# Altium schematic sheet LaserDriver.SchDoc: LaserDriver
size A3; Organization: Altium Limited; Address1: L3, 12a Rodborough Rd; Address2: Frenchs Forest; Address3: NSW; Address4: Australia 2086; SheetNumber: 1; SheetTotal: 1; Version: 1
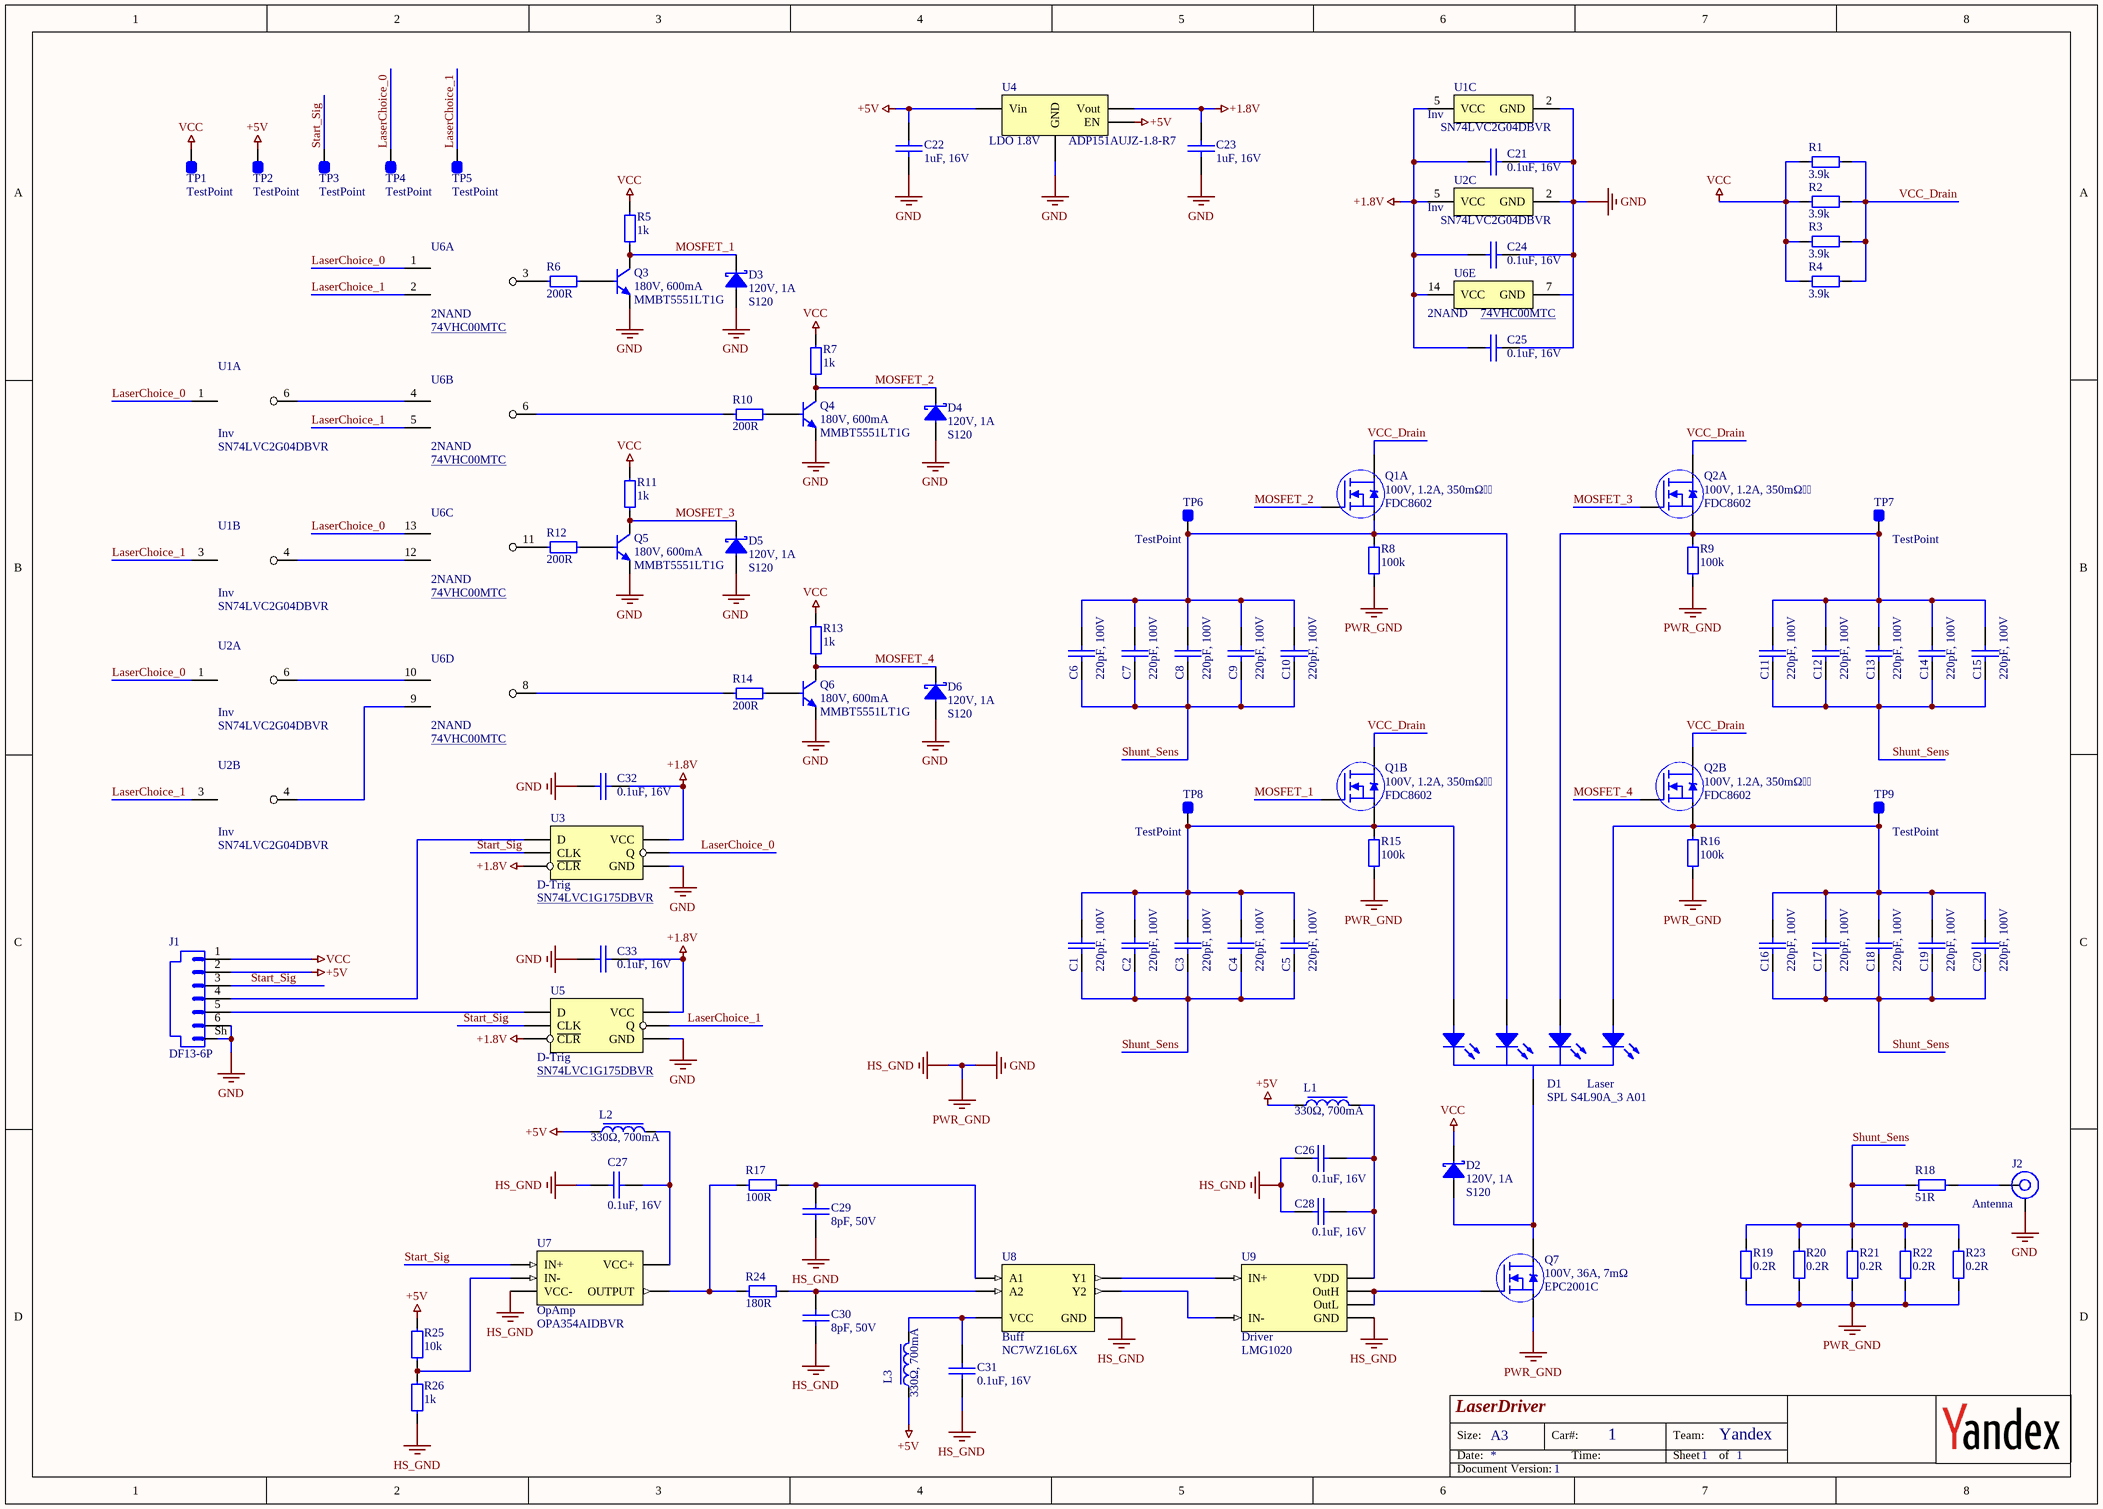
[diagram p0: LaserDriver.SchDoc]

## Parts
C1  220pF, 100V  [0402 Capicator]
C2  220pF, 100V  [0402 Capicator]
C3  220pF, 100V  [0402 Capicator]
C4  220pF, 100V  [0402 Capicator]
C5  220pF, 100V  [0402 Capicator]
C6  220pF, 100V  [0402 Capicator]
C7  220pF, 100V  [0402 Capicator]
C8  220pF, 100V  [0402 Capicator]
C9  220pF, 100V  [0402 Capicator]
C10  220pF, 100V  [0402 Capicator]
C11  220pF, 100V  [0402 Capicator]
C12  220pF, 100V  [0402 Capicator]
C13  220pF, 100V  [0402 Capicator]
C14  220pF, 100V  [0402 Capicator]
C15  220pF, 100V  [0402 Capicator]
C16  220pF, 100V  [0402 Capicator]
C17  220pF, 100V  [0402 Capicator]
C18  220pF, 100V  [0402 Capicator]
C19  220pF, 100V  [0402 Capicator]
C20  220pF, 100V  [0402 Capicator]
C21  0.1uF, 16V  [0402 Capicator]
C22  1uF, 16V  [0402 Capicator]
C23  1uF, 16V  [0402 Capicator]
C24  0.1uF, 16V  [0402 Capicator]
C25  0.1uF, 16V  [0402 Capicator]
C26  0.1uF, 16V  [0402 Capicator]
C27  0.1uF, 16V  [0402 Capicator]
C28  0.1uF, 16V  [0402 Capicator]
C29  8pF, 50V  [0603 Capicator]
C30  8pF, 50V  [0603 Capicator]
C31  0.1uF, 16V  [0402 Capicator]
C32  0.1uF, 16V  [0402 Capicator]
C33  0.1uF, 16V  [0402 Capicator]
D1  Laser  [SPL S4L90A_3 A01]
D2  120V, 1A  Part Number: S120  [SOD-123FL]
D3  120V, 1A  Part Number: S120  [SOD-123FL]
D4  120V, 1A  Part Number: S120  [SOD-123FL]
D5  120V, 1A  Part Number: S120  [SOD-123FL]
D6  120V, 1A  Part Number: S120  [SOD-123FL]
J1  DF13-6P  [DF13-6p-1.25H]
J2  Antenna  [IPX U. FL]
L1  330Ω, 700mA  [0402 Inductor]
L2  330Ω, 700mA  [0402 Inductor]
L3  330Ω, 700mA  [0402 Inductor]
Q1  100V, 1.2A, 350mΩ  Part Number: FDC8602  [SOT236]  (parts A,B of 2)
Q2  100V, 1.2A, 350mΩ  Part Number: FDC8602  [SOT236]  (parts A,B of 2)
Q3  180V, 600mA  Part Number: MMBT5551LT1G  [SOT-23]
Q4  180V, 600mA  Part Number: MMBT5551LT1G  [SOT-23]
Q5  180V, 600mA  Part Number: MMBT5551LT1G  [SOT-23]
Q6  180V, 600mA  Part Number: MMBT5551LT1G  [SOT-23]
Q7  100V, 36A, 7mΩ  [EPC2001C]
R1  3.9k  [0402 Resistor]
R2  3.9k  [0402 Resistor]
R3  3.9k  [0402 Resistor]
R4  3.9k  [0402 Resistor]
R5  1k  [0402 Resistor]
R6  200R  [0402 Resistor]
R7  1k  [0402 Resistor]
R8  100k  [0402 Resistor]
R9  100k  [0402 Resistor]
R10  200R  [0402 Resistor]
R11  1k  [0402 Resistor]
R12  200R  [0402 Resistor]
R13  1k  [0402 Resistor]
R14  200R  [0402 Resistor]
R15  100k  [0402 Resistor]
R16  100k  [0402 Resistor]
R17  100R  [0402 Resistor]
R18  51R  [0402 Resistor]
R19  0.2R  [0402 Resistor]
R20  0.2R  [0402 Resistor]
R21  0.2R  [0402 Resistor]
R22  0.2R  [0402 Resistor]
R23  0.2R  [0402 Resistor]
R24  180R  [0402 Resistor]
R25  10k  [0402 Resistor]
R26  1k  [0402 Resistor]
TP1  TestPoint  [TestPoint]
TP2  TestPoint  [TestPoint]
TP3  TestPoint  [TestPoint]
TP4  TestPoint  [TestPoint]
TP5  TestPoint  [TestPoint]
TP6  TestPoint  [TestPoint]
TP7  TestPoint  [TestPoint]
TP8  TestPoint  [TestPoint]
TP9  TestPoint  [TestPoint]
U1  Inv  Part Number: SN74LVC2G04DBVR  [SOT236]  (parts A,B,C of 3)
U2  Inv  Part Number: SN74LVC2G04DBVR  [SOT236]  (parts A,B,C of 3)
U3  D-Trig  Part Number: SN74LVC1G175DBVR  [SOT236]
U4  LDO 1.8V  Part Number: ADP151AUJZ-1.8-R7  [SOT-23-5]
U5  D-Trig  Part Number: SN74LVC1G175DBVR  [SOT236]
U6  2NAND  Part Number: 74VHC00MTC  [TSSOP-14]  (parts A,B,C,D,E of 5)
U7  OpAmp  Part Number: OPA354AIDBVR  [SOT-23-5]
U8  Buff  Part Number: NC7WZ16L6X  [MicroPak 6-Lead]
U9  Driver  Part Number: LMG1020  [WCSP]

## Nets
+1.8V: C21.1 C23.2 C24.1 C25.1 C32.2 C33.2 U1.5(VCC) U2.5(VCC) U3.5(VCC) U3.6(~{CLR}) U4.5(Vout) U5.5(VCC) U5.6(~{CLR}) U6.14(VCC)
+5V: C22.2 J1.2 L1.1 L2.1 L3.1 R25.2 TP2.1 U4.1(Vin) U4.3(EN)
GND: C21.2 C22.1 C23.1 C24.2 C25.2 C26.1 C27.1 C28.1 C29.2 C30.1 C31.1 C32.1 C33.1 D3.1 D4.1 D5.1 D6.1 J1.6 J1.Sh(A) J2.A(GND) Q3.2 Q4.2 Q5.2 Q6.2 Q7.4(Source) R8.1 R9.1 R15.1 R16.1 R19.1 R20.1 R21.1 R22.1 R23.1 R26.1 U1.2(GND) U2.2(GND) U3.2(GND) U4.2(GND) U5.2(GND) U6.7(GND) U7.2(VCC-) U8.2(GND) U9.B1(GND)  [also labelled HS_GND, PWR_GND]
VCC: D2.2 J1.1 R1.1 R2.1 R3.1 R4.1 R5.2 R7.2 R11.2 R13.2 TP1.1
LaserChoice_0: TP4.1 U1.1(1A) U2.1(1A) U3.4(Q) U6.1(A0) U6.13(A2)
LaserChoice_1: TP5.1 U1.3(2А) U2.3(2А) U5.4(Q) U6.2(B0) U6.5(B1)
MOSFET_1: D3.2 Q1.3(Gate) Q3.3 R5.1
MOSFET_2: D4.2 Q1.1(Gate) Q4.3 R7.1
MOSFET_3: D5.2 Q2.1(Gate) Q5.3 R11.1
MOSFET_4: D6.2 Q2.3(Gate) Q6.3 R13.1
Shunt_Sens: C1.2 C2.2 C3.2 C4.2 C5.2 C6.2 C7.2 C8.2 C9.2 C10.2 C11.2 C12.2 C13.2 C14.2 C15.2 C16.2 C17.2 C18.2 C19.2 C20.2 R18.1 R19.2 R20.2 R21.2 R22.2 R23.2
Start_Sig: J1.3 TP3.1 U3.1(CLK) U5.1(CLK) U7.3(IN+)
VCC_Drain: Q1.4(Drain) Q1.6(Drain) Q2.4(Drain) Q2.6(Drain) R1.2 R2.2 R3.2 R4.2
NetC1_1: C1.1 C2.1 C3.1 C4.1 C5.1 D1.1(Anode_ch1) Q1.2(Source) R15.2 TP8.1
NetC6_1: C6.1 C7.1 C8.1 C9.1 C10.1 D1.2(Anode_ch2) Q1.5(Source) R8.2 TP6.1
NetC11_1: C11.1 C12.1 C13.1 C14.1 C15.1 D1.3(Anode_ch3) Q2.5(Source) R9.2 TP7.1
NetC16_1: C16.1 C17.1 C18.1 C19.1 C20.1 D1.4(Anode_ch4) Q2.2(Source) R16.2 TP9.1
NetC26_2: C26.2 C28.2 L1.2 U9.A1(VDD)
NetC27_2: C27.2 L2.2 U7.5(VCC+)
NetC29_1: C29.1 R17.2 U8.1(A1)
NetC30_2: C30.2 R24.2 U8.3(A2)
NetC31_2: C31.2 L3.2 U8.5(VCC)
NetD1_5: D1.5(Cathode) D2.1 Q7.3(Drain)
NetJ1_4: J1.4 U3.3(D)
NetJ1_5: J1.5 U5.3(D)
NetJ2_1: J2.1(Antenna) R18.2
NetQ3_1: Q3.1 R6.2
NetQ4_1: Q4.1 R10.2
NetQ5_1: Q5.1 R12.2
NetQ6_1: Q6.1 R14.2
NetQ7_1: Q7.1(Gate) U9.A2(OutH) U9.B2(OutL)
NetR6_1: R6.1 U6.3(~{O}0)
NetR10_1: R10.1 U6.6(~{O}1)
NetR12_1: R12.1 U6.11(~{O}2)
NetR14_1: R14.1 U6.8(~{O}3)
NetR17_1: R17.1 R24.1 U7.1(OUTPUT)
NetR25_1: R25.1 R26.2 U7.4(IN-)
NetU1_4: U1.4(2Y) U6.12(B2)
NetU1_6: U1.6(1Y) U6.4(A1)
NetU2_4: U2.4(2Y) U6.9(B3)
NetU2_6: U2.6(1Y) U6.10(A3)
NetU8_4: U8.4(Y2) U9.C2(IN-)
NetU8_6: U8.6(Y1) U9.C1(IN+)

## Notes on the sheet
- Size:
- Date:
- A3
- Car#:
- Time:
- 1
- Team:
- Sheet
- Yandex
- of
- Document Version:

## Library data of the parts
C1-C20 = Cap 220pF (0402): NP0 220pF 100V 5% 0402; Manufacturer: TDK; Part Number: C1005C0G2A221J050BA; Type: Capacitor; ComponentLink1Description: Chip&Dip; ComponentLink1URL: https://www.chipdip.ru/product/c1005c0g2a221j050ba
C21 C24-C28 C31-C33 = Cap 0.1uF (0402): X7R 0.1uF 16V 10% 0402; Manufacturer: Murata Electronics; Part Number: GRM155R71C104KA88B; Type: Capacitor; ComponentLink1Description: Chip&Dip; ComponentLink1URL: https://www.chipdip.ru/product/grm155r71c104k
C22 C23 = Cap 1uF (0402): X5R 0.1uF 16V 10% 0402; Manufacturer: Murata Electronics; Part Number: GRM155R61C105KA12D; Type: Capacitor; ComponentLink1Description: Chip&Dip; ComponentLink1URL: https://www.chipdip.ru/product/grm155r61c105ka12d
C29 C30 = Cap 8pF (0603): 8pF±0.1pF NP0 50V 0603; Manufacturer: Murata Electronics; Part Number: GRM1885C1H8R0BA01D; Type: Capacitor; ComponentLink1Description: DigiKey; ComponentLink1URL: https://www.digikey.com/en/products/detail/murata-electronics/GRM1885C1H8R0BA01D/4421695?s=N4IgTCBcDaIOICUCyBGAHGgrAYRQCTQQAYAhAQSJQBEQBdAXyA
D1 = Laser 4 Channel: 4 Channel SMT Laser in QFN package; Manufacturer: OSRAM Opto Semiconductors; Type: Diode; ComponentLink1Description: DataSheet; ComponentLink1URL: https://www.osram.com/ecat/SMT%20Laser%20SPL%20S4L90A_3%20A01/com/en/class_pim_web_catalog_103489/prd_pim_device_4071163/#62a1fdff42f13778e2055fdc87c50fcb; ComponentLink2Description: Mouser; ComponentLink2URL: https://ru.mouser.com/ProductDetail/OSRAM-Opto-Semiconductors/SPL-S4L90A_3-A01?qs=OlC7AqGiEDn4aov%2F5GIeZw%3D%3D; Part Number: SPL S4L90A_3 A01
D2-D6 = Diode Schottky (SOD-123FL): Manufacturer: Yangzhou Yangjie Electronic Technology Co; Type: Diode; ComponentLink1Description: DataSheet; ComponentLink1URL: https://static.chipdip.ru/lib/152/DOC001152954.pdf; ComponentLink2Description: Chip&Dip; ComponentLink2URL: https://www.chipdip.ru/product/s120
J1 = Conn 6 [DF13]: [DF13-6P-1.25H]; pin to pad: Sh>A; Manufacturer: Hirose; Part Number: CL0536-0255-2-75; Type: Connector; ComponentLink1Description: Hirose; ComponentLink1URL: https://www.hirose.com/product/p/CL0536-0255-2-75?lang=ru
J2 = Connector SMT: [IPX U. FL]; Manufacturer: DIY BOX; ComponentLink1Description: AliExpress; ComponentLink1URL: https://aliexpress.ru/i/32666421757.html; Type: Connector; Part Number: IPX U. FL
L1-L3 = Ferrite Bead 330 (0402): Chip beads for power line. GHz noise countermeasure; Part Number: MPZ1005S331ET000; Manufacturer: TDK; Type: Inductor; ComponentLink1Description: DataSheet; ComponentLink1URL: https://product.tdk.com/en/system/files?file=dam/doc/product/emc/emc/beads/catalog/beads_commercial_power_mpz1005-e_en.pdf; ComponentLink2Description: DigiKey; ComponentLink2URL: https://www.digikey.com/en/products/detail/tdk-corporation/MPZ1005S331ET000/3910121?s=N4IgTCBcDaILIAUBaBGADGgrAZQMy5QFEAVDNEAXQF8g
Q1 Q2 = MOSFET-N x2 [FDC86]: Dual N-Channel Shielded Gate PowerTrench; Manufacturer: Onsemi; Type: Transistor; ComponentLink1Description: DataSheet; ComponentLink1URL: https://www.onsemi.com/pdf/datasheet/fdc8602-d.pdf; ComponentLink2Description: DigiKey; ComponentLink2URL: https://www.digikey.com/en/products/detail/onsemi/FDC8602/3025438
Q3-Q6 = NPN [MMBT]: NPN high voltage transistor. AEC−Q101 Qualified and PPAP Capable.; Manufacturer: ON Semiconductor; Type: Transistor; ComponentLink1Description: DataSheet; ComponentLink1URL: https://static.chipdip.ru/lib/933/DOC011933862.pdf; ComponentLink2Description: Chip&Dip; ComponentLink2URL: https://www.chipdip.ru/product/mmbt5551
Q7 = MOSFET-N [EPC]: eGaN FET; Manufacturer: EPC; Type: Transistor; ComponentLink1Description: DataSheet; ComponentLink1URL: https://epc-co.com/epc/Portals/0/epc/documents/datasheets/EPC2001C_datasheet.pdf; ComponentLink2Description: DigiKey; ComponentLink2URL: https://www.digikey.com/en/products/detail/epc/EPC2001C/5031688; Part Number: EPC2001C
R1-R4 = Res 3.9k (0402): 0.062W 0403 3.9k 1%; Part Number: RC0402FR-073K9L; Manufacturer: Taiwan; Type: Resistor; ComponentLink1Description: Chip&Dip; ComponentLink1URL: https://www.chipdip.ru/product0/9000189824
R5 R7 R11 R13 R26 = Res 1k (0402): 0.062W 0403 1k 1%; Part Number: RC0402FR-071KL; Manufacturer: Taiwan; Type: Resistor; ComponentLink1Description: Chip&Dip; ComponentLink1URL: https://www.chipdip.ru/product0/9000189652
R6 R10 R12 R14 = Res 200R (0402): 0.062W 0403 200R 1%; Part Number: RC0402FR-07200RL; Manufacturer: Taiwan; Type: Resistor; ComponentLink1Description: Chip&Dip; ComponentLink1URL: https://www.chipdip.ru/product0/9000189769
R8 R9 R15 R16 = Res 100k (0402): 0.062W 0403 100k 1%; Part Number: RC0402FR-07100KL; Manufacturer: Taiwan; Type: Resistor; ComponentLink1Description: Chip&Dip; ComponentLink1URL: https://www.chipdip.ru/product0/9000189665
R17 = Res 100R (0402): 0.062W 0403 100R, 1%; Part Number: RC0402JR-07100RL; Manufacturer: Taiwan; Type: Resistor; ComponentLink1Description: Chip&Dip; ComponentLink1URL: https://www.chipdip.ru/product0/9000189639
R18 = Res 51R (0402): 0.062W 0403 51R 1%; Part Number: RC0402FR-0751RL; Manufacturer: Taiwan; Type: Resistor; ComponentLink1Description: Chip&Dip; ComponentLink1URL: https://www.chipdip.ru/product0/9000189745
R19-R23 = Res 0.2R (0402): 0.125W 0402 0.2R, 1%; Part Number: UCR01MVPFLR200; Manufacturer: Rohm; Type: Resistor; ComponentLink1Description: DigiKey; ComponentLink1URL: https://www.digikey.com/en/products/detail/rohm-semiconductor/UCR01MVPFLR200/4053578?s=N4IgTCBcDaIKoGEBKAGAjAWQGoAUBiAMkmCiiALoC%2BQA
R24 = Res 180R (0402): 0.062W 0403 180R, 1%; Part Number: RC0402FR-07180RL; Manufacturer: Taiwan; Type: Resistor; ComponentLink1Description: Chip&Dip; ComponentLink1URL: https://www.chipdip.ru/product0/9000189767
R25 = Res 10k (0402): 0.062W 0403 10k 1%; Part Number: RC0402FR-0710KL; Manufacturer: Taiwan; Type: Resistor; ComponentLink1Description: Chip&Dip; ComponentLink1URL: https://www.chipdip.ru/product0/9000189664
U1 U2 = Inverter (SN74): Dual inverter, 1.65-5.5V; Manufacturer: Texas Instruments; ComponentLink1Description: Chip&Dip; ComponentLink1URL: https://www.chipdip.ru/product/sn74lvc2g04dbvr-2; ComponentLink2Description: DataSheet; ComponentLink2URL: https://static.chipdip.ru/lib/021/DOC001021810.pdf; Type: IC
U3 U5 = D-Trigger [SN74LVC1G175DBVR]: The single D-type flip-flop designed for 1.65-V to 5.5-V VCC operation; Manufacturer: Texas Instruments; ComponentLink1Description: DataSheet; ComponentLink1URL: https://static.chipdip.ru/lib/170/DOC001170956.pdf; ComponentLink2Description: Chip&Dip; ComponentLink2URL: https://www.chipdip.ru/product/sn74lvc1g175dbvr; Type: IC
U4 = LDO 1.8V [ADP]: Ultralow noise: 9 μV rms No noise bypass capacitor required Stable with 1 μF ceramic input and output capacitors Maximum output current: 200 mA Input voltage range: 2.2 V to 5.5 V; Manufacturer: Analog Devices; ComponentLink1Description: DataSheet; ComponentLink1URL: https://static.chipdip.ru/lib/986/DOC003986583.pdf; ComponentLink2Description: Chip&Dip; ComponentLink2URL: https://www.chipdip.ru/product/adp151aujz-1.8-r7; Type: IC
U6 = 4(2NAND) 1.5V Logic: 4 logic elements "2NAND"; Manufacturer: Fairchild Semiconductor; ComponentLink1Description: DataSheet; ComponentLink1URL: https://static.chipdip.ru/lib/318/DOC000318768.pdf; ComponentLink2Description: ChipDip; ComponentLink2URL: https://www.chipdip.ru/product/74vhc00mtc; Type: IC
U7 = OpAmp [OPA354]: The OPAx354 series of op amps are optimized for operation on single or dual supplies as low as 2.5 V (±1.25 V) and up to 5.5 V (±2.75 V). Common-mode input range extends beyond the supplies. The output swing is within 100 mV of the rails, supporting wide dynamic range.; Manufacturer: Texas Instruments; ComponentLink1Description: DataSheet; ComponentLink1URL: https://static.chipdip.ru/lib/876/DOC003876961.pdf; ComponentLink2Description: Chip&Dip; ComponentLink2URL: https://www.chipdip.ru/product/opa354aidbvr-ti; Type: IC
U8 = Buffer [NC7]: Dual buffer Ultra-High Speed Series. The  device is fabricated with advanced CMOS technology to achieve ultra-high speed  with high output drive while maintaining low static power dissipation over  a  very broad VCC operating range.; Manufacturer: Onsemi; ComponentLink1Description: DigiKey; ComponentLink1URL: https://www.digikey.com/en/products/detail/onsemi/NC7WZ16L6X/1050447?s=N4IgTCBcDaIHIGEDsB1AWgRgGwBksA0QBdAXyA; ComponentLink2Description: DataSheet; ComponentLink2URL: https://rocelec.widen.net/view/pdf/z73gngtavr/ONSM-S-A0003590680-1.pdf?t.download=true&u=5oefqw; Type: IC
U9 = MOSFET Driver [LMG]: The LM1501Aseries of regulators are monolithic integrated circuits that provideall the active functions for astep-down  switching  regulator,  capable  ofdriving  a  5A  load  with  excellent  line  and  load  regulation.; Manufacturer: Texas Instruments; ComponentLink1Description: DigiKey; ComponentLink1URL: https://www.digikey.com/en/products/detail/texas-instruments/LMG1020YFFT/9489635; ComponentLink2Description: DataSheet; ComponentLink2URL: https://www.ti.com/lit/ds/symlink/lmg1020.pdf?HQS=dis-dk-null-digikeymode-dsf-pf-null-wwe&ts=1633629477689&ref_url=https%253A%252F%252Fwww.ti.com%252Fgeneral%252Fdocs%252Fsuppproductinfo.tsp%253FdistId%253D10%2526gotoUrl%253Dhttps%253A%252F%252Fwww.ti.com%252Flit%252Fgpn%252Flmg1020; Type: IC